# Altium schematic sheet USB.SchDoc: Mynd-USB-PD
size A3; PageSetup: Record=PageOptions|CenterHorizontal=True|CenterVertical=True|PrintScale=0.71|XCorrection=1.00|YCorrection=1.00|PrintKind=0|BorderSize=5000000|LeftOffset=0|BottomOffset=0|Orientation=2|PaperLength=1000|PaperWidth=1000|Scale=100|PaperSource=7|PrintQuality=-3|MediaType=1|DitherType=10|PrintScaleMode=1|PaperKind=A4|PaperIndex=9; SheetNumber: 2; SheetTotal: 6
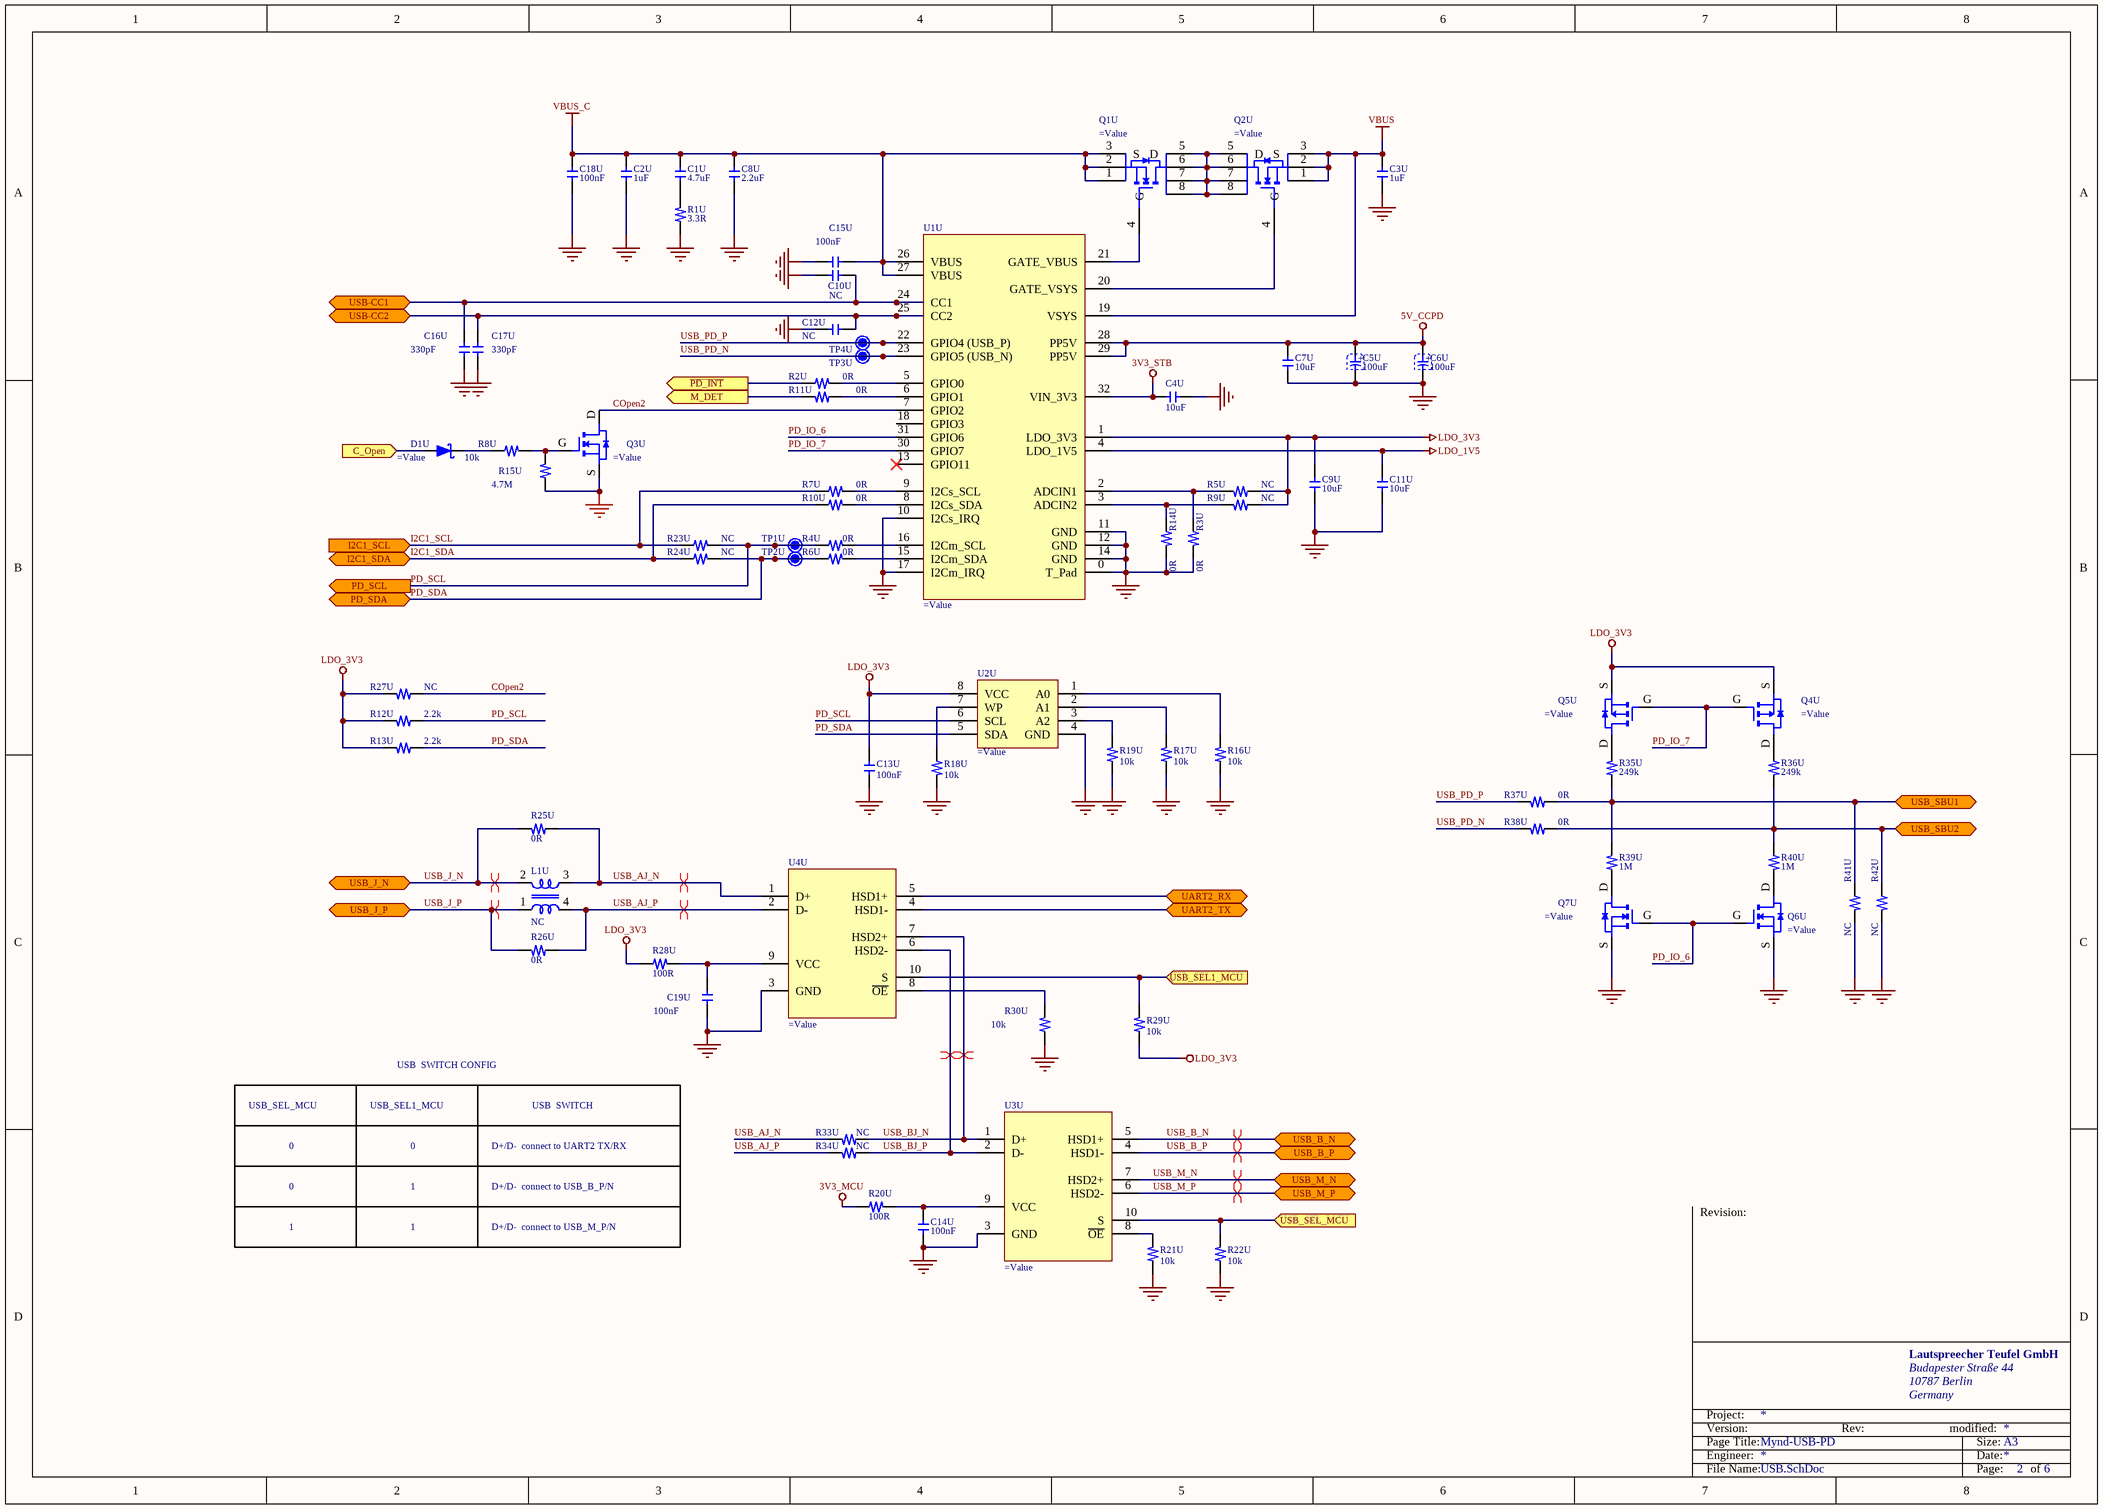
[diagram p0: USB.SchDoc]

## Parts
C1U  4.7uF  [C0805_145]
C2U  1uF  [C0805_145]
C3U  1uF  [C0805_145]
C4U  10uF  [C0805_145]
C5U  100uF  [ECAP_SMD_630X540]
C6U  100uF  [ECAP_SMD_630X540]
C7U  10uF  [C0805_145]
C8U  2.2uF  [C0805_145]
C9U  10uF  [C0805_145]
C10U  330pF  [C0603X80]  (value not drawn)
C11U  10uF  [C0805_145]
C12U  330pF  [C0603X80]  (value not drawn)
C13U  100nF  [C0603X100]
C14U  100nF  [C0603X100]
C15U  100nF  [C0603X105]
C16U  330pF  [C0603X80]
C17U  330pF  [C0603X80]
C18U  100nF  [C0603X105]
C19U  100nF  [C0603X100]
D1U  (no value)  [SOD-323]
L1U  NC  [CET2012D]
Q1U  (no value)  [DFN8_500X600X100_127_A]
Q2U  (no value)  [DFN8_500X600X100_127_A]
Q3U  (no value)  [SOT23-GSD]
Q4U  (no value)  [SOT23-GSD]
Q5U  (no value)  [SOT23-GSD]
Q6U  (no value)  [SOT23_16_GSD]
Q7U  (no value)  [SOT23_16_GSD]
R1U  3.3R  [R0603]
R2U  0R  [R0603]
R3U  0R  [R0603]
R4U  0R  [R0603]
R5U  13k  [R0603]  (value not drawn)
R6U  0R  [R0603]
R7U  0R  [R0603]
R8U  10k  [R0603]
R9U  13k  [R0603]  (value not drawn)
R10U  0R  [R0603]
R11U  0R  [R0603]
R12U  2.2k  [R0603]
R13U  2.2k  [R0603]
R14U  0R  [R0603]
R15U  4.7M  [R0603]
R16U  10k  [R0603]
R17U  10k  [R0603]
R18U  10k  [R0603]
R19U  10k  [R0603]
R20U  100R  [R0603]
R21U  10k  [R0603]
R22U  10k  [R0603]
R23U  0R  [R0603]  (value not drawn)
R24U  0R  [R0603]  (value not drawn)
R25U  0R  [R0603]
R26U  0R  [R0603]
R27U  2.2k  [R0603]  (value not drawn)
R28U  100R  [R0603]
R29U  10k  [R0603]
R30U  10k  [R0603]
R33U  0R  [R0603]  (value not drawn)
R34U  0R  [R0603]  (value not drawn)
R35U  249k  [R0402]
R36U  249k  [R0402]
R37U  0R  [R0603]
R38U  0R  [R0603]
R39U  1M  [R0402]
R40U  1M  [R0402]
R41U  0R  [R0603]  (value not drawn)
R42U  0R  [R0603]  (value not drawn)
TP1U  TP_T_60_40  [TP_T_60_40]  (value not drawn)  (no BOM)
TP2U  TP_T_60_40  [TP_T_60_40]  (value not drawn)  (no BOM)
TP3U  TP06  [TP060]  (value not drawn)  (no BOM)
TP4U  TP06  [TP060]  (value not drawn)  (no BOM)
U1U  (no value)  [QFN32_400X400X80_40_P280X280_A]
U2U  (no value)  [SO-8]
U3U  (no value)  [QFN10_180X140X60_40]
U4U  (no value)  [QFN10_180X140X60_40]

## Ports
C_Open (in), I2C1_SCL (in), I2C1_SDA (bidir), M_DET (out), PD_SCL (out), PD_SDA (bidir), UART2_RX (bidir), UART2_TX (bidir), USB-CC1 (bidir), USB-CC2 (bidir), USB_B_N (bidir), USB_B_P (bidir), USB_J_N (bidir), USB_J_P (bidir), USB_M_N (bidir), USB_M_P (bidir), USB_SBU1 (bidir), USB_SBU2 (bidir), USB_SEL1_MCU (in), USB_SEL_MCU (in), ~{PD_INT} (out)

## Nets
3V3_MCU: R20U.1
3V3_STB: C4U.2 U1U.32(VIN_3V3)
5V_CCPD: C5U.1 C6U.1 C7U.2 U1U.28(PP5V) U1U.29(PP5V)
GND: C2U.2 C3U.2 C4U.1 C5U.2 C6U.2 C7U.1 C8U.2 C9U.1 C10U.2 C11U.1 C12U.2 C13U.2 C14U.2 C15U.2 C16U.2 C17U.2 C18U.2 C19U.2 Q3U.S Q6U.S Q7U.S R1U.1 R3U.2 R14U.2 R15U.2 R16U.2 R17U.2 R18U.1 R19U.2 R21U.1 R22U.1 R30U.1 R41U.1 R42U.1 U1U.0(T_Pad) U1U.10(I2Cs_IRQ) U1U.11(GND) U1U.12(GND) U1U.14(GND) U1U.17(I2Cm_IRQ) U2U.4(GND) U3U.3(GND) U4U.3(GND)
LDO_1V5: C11U.2 U1U.4(LDO_1V5)
LDO_3V3: C9U.2 C13U.1 Q4U.S Q5U.S R5U.1 R9U.1 R12U.2 R13U.2 R27U.2 R28U.1 R29U.1 U1U.1(LDO_3V3) U2U.8(VCC)
VBUS: C3U.1 Q2U.1(S) Q2U.2(S) Q2U.3(S) U1U.19(VSYS)
VBUS_C: C1U.1 C2U.1 C8U.1 C15U.1 C18U.1 Q1U.1(S) Q1U.2(S) Q1U.3(S) U1U.26(VBUS) U1U.27(VBUS)
~{PD_INT}: R2U.1 ; port ~{PD_INT}
C_Open: D1U.A ; port C_Open
COpen2: Q3U.D R27U.1 U1U.7(GPIO2)
I2C1_SCL: R7U.1 R23U.1 ; port I2C1_SCL
I2C1_SDA: R10U.1 R24U.1 ; port I2C1_SDA
M_DET: R11U.2 ; port M_DET
PD_IO_6: Q6U.G Q7U.G U1U.31(GPIO6)
PD_IO_7: Q4U.G Q5U.G U1U.30(GPIO7)
PD_SCL: R4U.1 R12U.1 R23U.2 TP1U.1 U2U.6(SCL) ; port PD_SCL
PD_SDA: R6U.1 R13U.1 R24U.2 TP2U.1 U2U.5(SDA) ; port PD_SDA
UART2_RX: U4U.5(HSD1+) ; port UART2_RX
UART2_TX: U4U.4(HSD1-) ; port UART2_TX
USB-CC1: C10U.1 C16U.1 U1U.24(CC1) ; port USB-CC1
USB-CC2: C12U.1 C17U.1 U1U.25(CC2) ; port USB-CC2
USB_AJ_N: L1U.3 R25U.2 R33U.1 U4U.1(D+)
USB_AJ_P: L1U.4 R26U.2 R34U.1 U4U.2(D-)
USB_B_N: U3U.5(HSD1+) ; port USB_B_N
USB_B_P: U3U.4(HSD1-) ; port USB_B_P
USB_BJ_N: R33U.2 U3U.1(D+) U4U.7(HSD2+)
USB_BJ_P: R34U.2 U3U.2(D-) U4U.6(HSD2-)
USB_J_N: L1U.2 R25U.1 ; port USB_J_N
USB_J_P: L1U.1 R26U.1 ; port USB_J_P
USB_M_N: U3U.7(HSD2+) ; port USB_M_N
USB_M_P: U3U.6(HSD2-) ; port USB_M_P
USB_PD_N: R38U.2 TP3U.1 U1U.23(GPIO5_(USB_N))
USB_PD_P: R37U.1 TP4U.1 U1U.22(GPIO4_(USB_P))
USB_SBU1: R35U.2 R37U.2 R39U.1 R41U.2 ; port USB_SBU1
USB_SBU2: R36U.2 R38U.1 R40U.1 R42U.2 ; port USB_SBU2
USB_SEL1_MCU: R29U.2 U4U.10(S) ; port USB_SEL1_MCU
USB_SEL_MCU: R22U.2 U3U.10(S) ; port USB_SEL_MCU
NetC1U_2: C1U.2 R1U.2
NetC14U_1: C14U.1 R20U.2 U3U.9(VCC)
NetC19U_1: C19U.1 R28U.2 U4U.9(VCC)
NetD1U_K: D1U.K R8U.1
NetQ1U_4: Q1U.4(G) U1U.21(GATE_VBUS)
NetQ1U_5: Q1U.5(D) Q1U.6(D) Q1U.7(D) Q1U.8(D) Q2U.5(D) Q2U.6(D) Q2U.7(D) Q2U.8(D)
NetQ2U_4: Q2U.4(G) U1U.20(GATE_VSYS)
NetQ3U_G: Q3U.G R8U.2 R15U.1
NetQ4U_D: Q4U.D R36U.1
NetQ5U_D: Q5U.D R35U.1
NetQ6U_D: Q6U.D R40U.2
NetQ7U_D: Q7U.D R39U.2
NetR2U_2: R2U.2 U1U.5(GPIO0)
NetR3U_1: R3U.1 R5U.2 U1U.2(ADCIN1)
NetR4U_2: R4U.2 U1U.16(I2Cm_SCL)
NetR6U_2: R6U.2 U1U.15(I2Cm_SDA)
NetR7U_2: R7U.2 U1U.9(I2Cs_SCL)
NetR9U_2: R9U.2 R14U.1 U1U.3(ADCIN2)
NetR10U_2: R10U.2 U1U.8(I2Cs_SDA)
NetR11U_1: R11U.1 U1U.6(GPIO1)
NetR16U_1: R16U.1 U2U.1(A0)
NetR17U_1: R17U.1 U2U.2(A1)
NetR18U_2: R18U.2 U2U.7(WP)
NetR19U_1: R19U.1 U2U.3(A2)
NetR21U_2: R21U.2 U3U.8(~{OE})
NetR30U_2: R30U.2 U4U.8(~{OE})

Not connected (* = marked no-connect by the designer): U1U 13(GPIO11)* 18(GPIO3)

## Layout directives
differential pair: USB_AJ_N, USB_AJ_P, USB_B_N, USB_B_P, USB_BJ_N, USB_BJ_P, USB_J_N, USB_J_P, USB_M_N, USB_M_P

## Notes on the sheet
- NC
- (near C12U) NC
- (near R27U) NC
- (near R41U) NC
- USB_SEL_MCU
- USB_SEL1_MCU
- USB  SWITCH CONFIG
- USB  SWITCH
- 0
- 1
- D+/D-  connect to UART2 TX/RX
- D+/D-  connect to USB_B_P/N
- (near R33U) NC
- D+/D-  connect to USB_M_P/N
- Revision:
- Lautspreecher Teufel GmbH
- Budapester Straße 44
- 10787 Berlin
- Germany
- Page Title:
- Engineer:
- Project:
- Version:
- Rev:
- modified:
- Date:
- Size:
- A3
- File Name:
- Page:
- of
- (in symbol P-001-0308-17) +

## Library data of the parts
C1U = P-001-0169-16: PSHF SMD M CAP 4.7uF 25V ±10% 0805 X7R; Manufacturer: Multi Sourced; Part_Number: Generic; Part_Type: Capacitor ceramic SMT; Tolerance: ±10%; TemperatureRange: X7R; Value: 4.7uF; Temp_Coefficient: X7R; Voltage: 25V
C2U C3U = P-001-0174-47: PSHF SMD M CAP 1uF 50V ±10% 0805 X7R; Manufacturer: Multi Sourced; Part_Number: Generic; Part_Type: Capacitor ceramic SMT; Tolerance: ±10%; TemperatureRange: X7R; Value: 1uF; Temp_Coefficient: X7R; Voltage: 50V
C4U C7U C9U C11U = P-001-0158-27: PSHF SMD M CAP 10uF 16V ±10% 0805 X7R; Manufacturer: Multi Sourced; Part_Number: Generic; Part_Type: Capacitor ceramic SMT; Tolerance: ±10%; TemperatureRange: X7R; Value: 10uF; Temp_Coefficient: X7R; Voltage: 16V
C5U C6U = P-001-0308-17: PS SMD COND ELECT 100uF 16V ±20% 105℃; Manufacturer: Multi Sourced; Part_Number: Generic; Part_Type: Capacitor electrolytic SMT; Tolerance: ±20%; TemperatureRange: 105℃; Value: 100uF; Voltage: 16V
C8U = P-001-0127-42: GPHF $ SMD M CAP 2.2uF 50V ±10% 0805 X5R; Manufacturer: Multi Sourced; Part_Number: Generic; Part_Type: Capacitor ceramic SMT; Tolerance: ±10%; TemperatureRange: X5R; Value: 2.2uF; Temp_Coefficient: X5R; Voltage: 50V
C10U C12U = P-001-0636-13: PSHF SMD M CAP 330pF 50V ±10% 0603 X7R; Manufacturer: Multi Sourced; Part_Number: Generic; Part_Type: Capacitor ceramic SMT; Tolerance: ±10%; TemperatureRange: X7R; Value: 330pF; Temp_Coefficient: X7R; Voltage: 50V
C13U C14U C19U = P-001-0035-28: PSHF SMD M CAP 100nF 25V ±10% 0603 X7R; Manufacturer: Multi Sourced; Part_Number: Generic; Part_Type: Capacitor ceramic SMT; Tolerance: ±10%; TemperatureRange: X7R; Value: 100nF; Temp_Coefficient: X7R; Voltage: 25V
C15U C18U = P-001-0008-46: GPHF SMD M CAP 100nF 50V ±5% 0603 X7R; Manufacturer: Multi Sourced; Part_Number: Generic; Part_Type: Capacitor ceramic SMT; Tolerance: ±5%; TemperatureRange: X7R; Value: 100nF; Temp_Coefficient: X7R; Voltage: 50V
C16U C17U = P-001-0387-48: GPHF SMD M CAP 330pF 50V ±5% 0603 NPO; Manufacturer: Multi Sourced; Part_Number: Generic; Part_Type: Capacitor ceramic SMT; Tolerance: ±5%; TemperatureRange: NPO; Value: 330pF; Temp_Coefficient: NPO; Voltage: 50V
D1U = R-001-0029-31: GP SMD DIODE 2P 30V SOD323 BAT54WS PANJIT; Part_Type: Semiconductor Diode SMT; Current: 0.2A; Manufacturer: PANJIT; Voltage: 30V; Value: BAT54WS; Part_Number: BAT54WS
L1U = S-001-0426-3: COMMON MODE COIL 90Ohm 100MHz 400mA; Manufacturer: CET CHAMPI; Part_Number: CET2012A-900S; Part_Type: Coil common Mode SMT; Value: 90R; Frequency: 100MHz; Current: 400mA
Q1U Q2U = R-001-0189-21: PS SMD FET 8P DFN8 AP4024GEMT-HF APEC; Manufacturer: [APEC]; Part_Type: Semiconductor Transistor SMT; Current: 60A; Voltage: 30V; Value: AP4024GEMT-HF; Part_Number: AP4024GEMT-HF
Q3U = R-001-0217-30: GP SMD FET 3P SOT23 2N7002K CTE; Part_Type: Semiconductor Transistor SMT; Current: 300MA; Voltage: 60V; Manufacturer: CTE; Value: 2N7002K; Part_Number: 2N7002K
Q4U Q5U = R-001-1323-5: GPHF SMD FET 3P -30V SOT-23 CJ3401 CJ; Part_Type: Semiconductor Transistor SMT; Current: -4.2V; Voltage: -30; Manufacturer: CJ; Value: CJ3401; Part_Number: CJ3401
Q6U Q7U = R-001-0313-12: GP FET 3P AO3402 SOT23 ALPHA 30V/4A; Manufacturer: AOS; Part_Type: Semiconductor Transistor SMT; Current: 4A; Voltage: 30V; Value: AO3402; Part_Number: AO3402
R1U = Q-001-0403-21: PS SMD RES. 3.3OHM 1/10W 1% 0603; Manufacturer: Multi-Sourced; Part_Number: Generic; Part_Type: Resistor SMT; Temp_Coefficient: 150ppm; Tolerance: 1%; Wattage: 1/10W; Value: 3.3R
R2U R4U R6U R7U R10U R11U R23U R24U = Q-001-0048-199: PS SMD RES. 0OHM 1/10W 5% 0603; Part_Type: Resistor SMT; Manufacturer: Multi-Sourced; Part_Number: Generic; Tolerance: 1%; Temp_Coefficient: 150ppm; Value: 0R; Wattage: 1/10W
R3U R14U R25U R26U R33U R34U R37U R38U R41U R42U = Q-001-0048-204: GPHF SMD RES. 0OHM 1/10W 5% 0603; Manufacturer: Multi-Sourced; Part_Number: Generic; Part_Type: Resistor SMT; Temp_Coefficient: 150ppm; Tolerance: 5%; Wattage: 1/10W; Value: 0R
R5U R9U = Q-001-0304-23: GPHF SMD RES. 13KOHM 1/10W 1% 0603; Manufacturer: Multi-Sourced; Part_Number: Generic; Part_Type: Resistor SMT; Temp_Coefficient: 150ppm; Tolerance: 1%; Wattage: 1/10W; Value: 13k
R8U = Q-001-0058-52: GPHF SMD RES. 10KOHM 1/10W 5% 0603; Manufacturer: Multi-Sourced; Part_Number: Generic; Part_Type: Resistor SMT; Temp_Coefficient: 150ppm; Tolerance: 5%; Wattage: 1/10W; Value: 10k
R12U R13U R27U = Q-001-0707-47: PS SMD RES. 2.2KOHM 1/10W 1% 0603; Part_Type: Resistor SMT; Manufacturer: Multi-Sourced; Part_Number: Generic; Temp_Coefficient: 150ppm; Tolerance: 1%; Value: 2.2k; Wattage: 1/10W
R15U = Q-001-0091-19: PS SMD RES. 4.7MOHM 1/10W 5% 0603; Manufacturer: Multi-Sourced; Part_Number: Generic; Part_Type: Resistor SMT; Temp_Coefficient: 150ppm; Tolerance: 5%; Wattage: 1/10W; Value: 4.7M
R16U R17U R18U R19U R21U R22U R29U R30U = Q-001-0036-48: PS SMD RES. 10KOHM 1/10W 1% 0603; Part_Type: Resistor SMT; Manufacturer: Multi-Sourced; Part_Number: Generic; Temp_Coefficient: 150ppm; Tolerance: 1%; Value: 10k; Wattage: 1/10W
R20U R28U = Q-001-0256-20: PS SMD RES. 100OHM 1/10W 1% 0603; Part_Type: Resistor SMT; Manufacturer: Multi-Sourced; Part_Number: Generic; Temp_Coefficient: 150ppm; Tolerance: 1%; Value: 100R; Wattage: 1/10W
R35U R36U = Q-001-1001-6: GPHF SMD RES. 249KOhm 1/16W 1% 0402; Manufacturer: Multi-Sourced; Part_Number: Generic; Part_Type: Resistor SMT; Temp_Coefficient: 150ppm; Tolerance: 1%; Wattage: 1/16W; Value: 249k
R39U R40U = Q-001-0226-61: GPHF SMD RES. 1MOHM 1/16W 1% 0402; Manufacturer: Multi-Sourced; Part_Number: Generic; Part_Type: Resistor SMT; Temp_Coefficient: 150ppm; Tolerance: 1%; Wattage: 1/16W; Value: 1M
TP1U TP2U = CMP-00089-1: Test Point; Design Item ID: TP
TP3U TP4U = N-001-00007-3: Test Point; Design Item ID: TP
U1U = R-001-1946-2: SMD IC 32P VQFN PTPS25751SRSMR TI; Part_Type: Semiconductor Integrated Circuit SMT; Manufacturer: TI; Value: PTPS25751SRSMR; Part_Number: PTPS25751SRSMR
U2U = R-001-2127-2: SMD IC 8P SOP8 FT24C512A-TSR-T; Manufacturer: HUIMANG; Part_Type: Semiconductor Integrated Circuit SMT; Value: FT24C512A-TSR-T; Part_Number: FT24C512A-TSR-T
U3U U4U = R-001-1355-8: GS SMD IC 10P UTQFN SGM7227YUWQ10G SGMICRO; Manufacturer: [SGMICRO]; Part_Type: Semiconductor Integrated Circuit SMT; Value: SGM7227YUWQ10G; Part_Number: SGM7227YUWQ10G